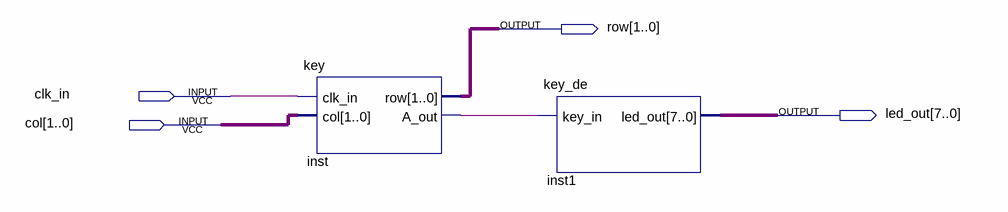
[diagram p0: schematic sheet]
// Quartus schematic key_test.bdf as structural Verilog: 2 symbols, 4 pins
module key_test (
  input  clk_in,
  input  [1:0] col,
  output [1:0] row,
  output [7:0] led_out
);

  wire inst_a_out;

  key inst (.clk_in(clk_in), .col(col), .row(row), .A_out(inst_a_out));
  key_de inst1 (.key_in(inst_a_out), .led_out(led_out));
endmodule
